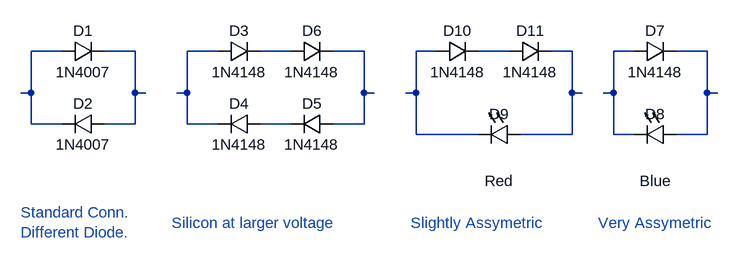
[diagram p0: schematic diode options.asc]
diode options.asc, the LTspice schematic file:
Version 4
SHEET 1 1396 680
WIRE 160 -32 112 -32
WIRE 272 -32 224 -32
WIRE 400 -32 352 -32
WIRE 512 -32 464 -32
WIRE 624 -32 576 -32
WIRE 736 -32 704 -32
WIRE 848 -32 800 -32
WIRE 944 -32 912 -32
WIRE 1040 -32 1008 -32
WIRE 1152 -32 1104 -32
WIRE 112 32 112 -32
WIRE 112 32 96 32
WIRE 272 32 272 -32
WIRE 288 32 272 32
WIRE 352 32 352 -32
WIRE 352 32 336 32
WIRE 624 32 624 -32
WIRE 640 32 624 32
WIRE 704 32 704 -32
WIRE 704 32 688 32
WIRE 944 32 944 -32
WIRE 960 32 944 32
WIRE 1008 32 1008 -32
WIRE 1008 32 992 32
WIRE 1152 32 1152 -32
WIRE 1168 32 1152 32
WIRE 112 80 112 32
WIRE 160 80 112 80
WIRE 272 80 272 32
WIRE 272 80 224 80
WIRE 352 80 352 32
WIRE 400 80 352 80
WIRE 512 80 464 80
WIRE 624 80 624 32
WIRE 624 80 576 80
WIRE 704 96 704 32
WIRE 800 96 704 96
WIRE 944 96 944 32
WIRE 944 96 864 96
WIRE 1008 96 1008 32
WIRE 1040 96 1008 96
WIRE 1152 96 1152 32
WIRE 1152 96 1104 96
SYMBOL diode 400 -16 R270
WINDOW 0 32 32 VTop 2
WINDOW 3 0 32 VBottom 2
SYMATTR InstName D3
SYMATTR Value 1N4148
SYMBOL diode 160 -16 R270
WINDOW 0 32 32 VTop 2
WINDOW 3 0 32 VBottom 2
SYMATTR InstName D1
SYMATTR Value 1N4007
SYMBOL diode 224 64 R90
WINDOW 0 0 32 VBottom 2
WINDOW 3 32 32 VTop 2
SYMATTR InstName D2
SYMATTR Value 1N4007
SYMBOL diode 464 64 R90
WINDOW 0 0 32 VBottom 2
WINDOW 3 32 32 VTop 2
SYMATTR InstName D4
SYMATTR Value 1N4148
SYMBOL diode 576 64 R90
WINDOW 0 0 32 VBottom 2
WINDOW 3 32 32 VTop 2
SYMATTR InstName D5
SYMATTR Value 1N4148
SYMBOL diode 512 -16 R270
WINDOW 0 32 32 VTop 2
WINDOW 3 0 32 VBottom 2
SYMATTR InstName D6
SYMATTR Value 1N4148
SYMBOL diode 1040 -16 R270
WINDOW 0 32 32 VTop 2
WINDOW 3 0 32 VBottom 2
SYMATTR InstName D7
SYMATTR Value 1N4148
SYMBOL LED 1104 80 R90
WINDOW 0 0 32 VBottom 2
WINDOW 3 72 32 VTop 2
SYMATTR InstName D8
SYMATTR Value Blue
SYMBOL LED 864 80 R90
WINDOW 0 0 32 VBottom 2
WINDOW 3 72 32 VTop 2
SYMATTR InstName D9
SYMATTR Value Red
SYMBOL diode 736 -16 R270
WINDOW 0 32 32 VTop 2
WINDOW 3 0 32 VBottom 2
SYMATTR InstName D10
SYMATTR Value 1N4148
SYMBOL diode 848 -16 R270
WINDOW 0 32 32 VTop 2
WINDOW 3 0 32 VBottom 2
SYMATTR InstName D11
SYMATTR Value 1N4148
TEXT 96 216 Left 2 ;Standard Conn.\nDifferent Diode.
TEXT 328 232 Left 2 ;Silicon at larger voltage
TEXT 696 232 Left 2 ;Slightly Assymetric
TEXT 984 232 Left 2 ;Very Assymetric

The netlist it stands for:
* diode options.asc
D3 N003 N004 1N4148
D1 N001 N002 1N4007
D2 N002 N001 1N4007
D4 N011 N003 1N4148
D5 N005 N011 1N4148
D6 N004 N005 1N4148
D7 N009 N010 1N4148
D8 N010 N009 Blue
D9 N008 N006 Red
D10 N006 N007 1N4148
D11 N007 N008 1N4148
.model D D
.lib standard.dio
* Standard Conn.
* Different Diode.
* Silicon at larger voltage
* Slightly Assymetric
* Very Assymetric
.backanno
.end